# Altium schematic sheet td2_cpu_r00.SchDoc
size B
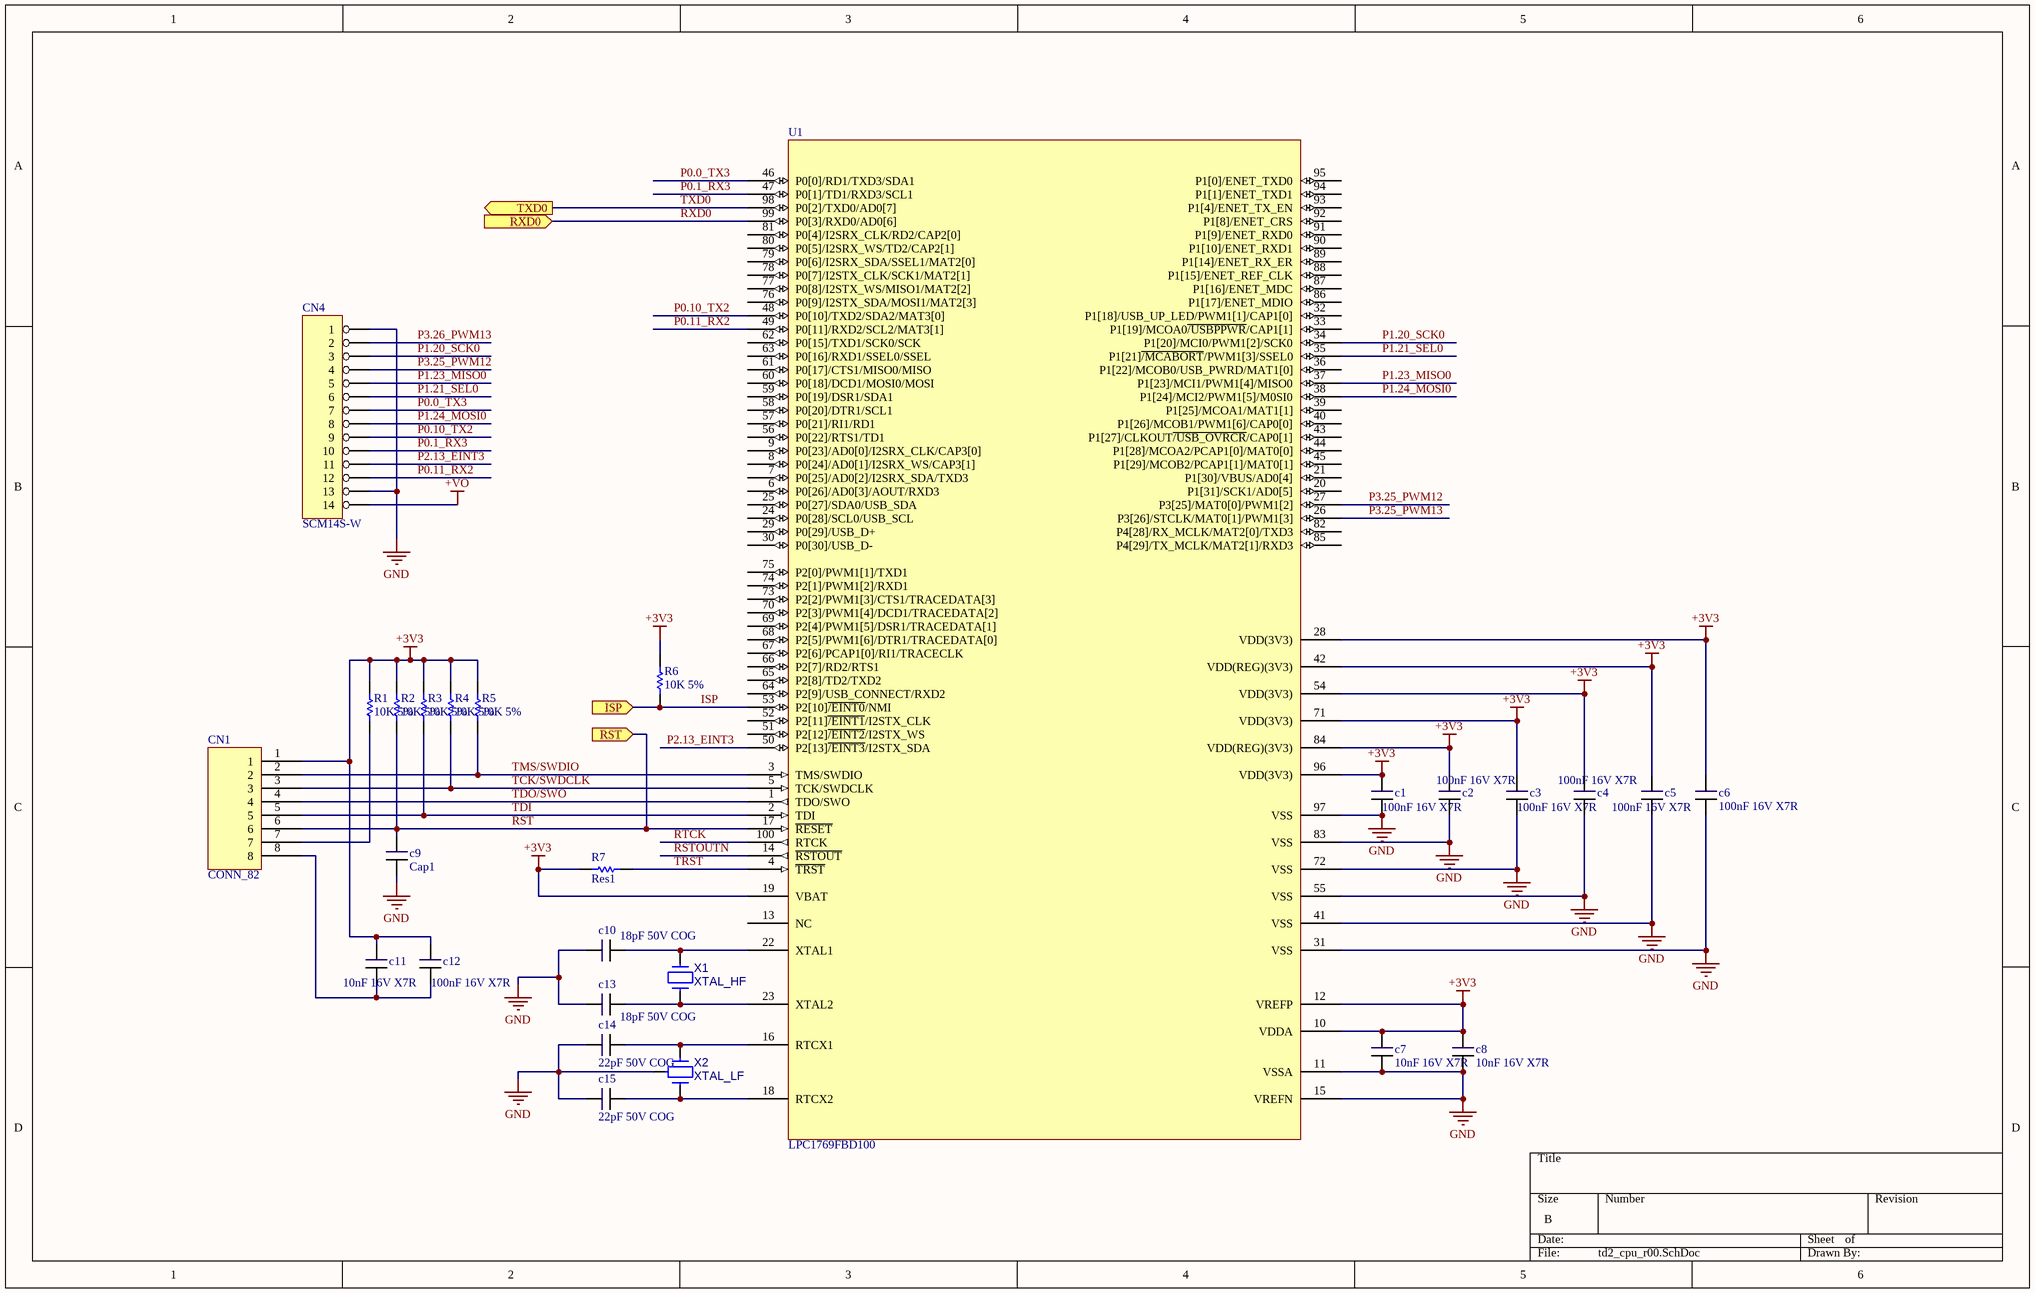
[diagram p0: td2_cpu_r00.SchDoc]

## Parts
c1  100nF 16V X7R
c2  100nF 16V X7R
c3  100nF 16V X7R
c4  100nF 16V X7R
c5  100nF 16V X7R
c6  100nF 16V X7R
c7  10nF 16V X7R
c8  10nF 16V X7R
c9  Cap1
c10  18pF 50V COG
c11  10nF 16V X7R
c12  100nF 16V X7R
c13  18pF 50V COG
c14  22pF 50V COG
c15  22pF 50V COG
CN1  CONN_82
CN4  SCM14S-W
R1  10K 5%
R2  10K 5%
R3  10K 5%
R4  10K 5%
R5  10K 5%
R6  10K 5%
R7  Res1
U1  LPC1769FBD100  [LQFP100]
X1  XTAL_HF
X2  XTAL_LF

## Ports
ISP (in), RST (in), RXD0 (in), TXD0 (out)

## Nets
+3V3: c1.2 c2.2 c3.2 c4.2 c5.2 c6.2 c7.2 c8.2 c11.2 c12.2 CN1.1 R1.2 R2.2 R3.2 R4.2 R5.2 R6.1 R7.2 U1.10(VDDA) U1.12(VREFP) U1.19(VBAT) U1.28(VDD(3V3)) U1.42(VDD(REG)(3V3)) U1.54(VDD(3V3)) U1.71(VDD(3V3)) U1.84(VDD(REG)(3V3)) U1.96(VDD(3V3))
+VO: CN4.14
GND: c1.1(tutu) c2.1(tutu) c3.1(tutu) c4.1(tutu) c5.1(tutu) c6.1(tutu) c7.1(tutu) c8.1(tutu) c9.1(tutu) c10.2 c13.2 c14.2 c15.2 CN4.1 CN4.13 U1.11(VSSA) U1.15(VREFN) U1.31(VSS) U1.41(VSS) U1.55(VSS) U1.72(VSS) U1.83(VSS) U1.97(VSS) X2.3
ISP: R6.2 U1.53(P2[10]~{/EINT0}/NMI) ; port ISP
P0.0_TX3: CN4.7 U1.46(P0[0]/RD1/TXD3/SDA1)
P0.1_RX3: CN4.10 U1.47(P0[1]/TD1/RXD3/SCL1)
P0.10_TX2: CN4.9 U1.48(P0[10]/TXD2/SDA2/MAT3[0])
P0.11_RX2: CN4.12 U1.49(P0[11]/RXD2/SCL2/MAT3[1])
P1.20_SCK0: CN4.3 U1.34(P1[20]/MCI0/PWM1[2]/SCK0)
P1.21_SEL0: CN4.6 U1.35(P1[21]~{/MCABORT}/PWM1[3]/SSEL0)
P1.23_MISO0: CN4.5 U1.37(P1[23]/MCI1/PWM1[4]/MISO0)
P1.24_MOSI0: CN4.8 U1.38(P1[24]/MCI2/PWM1[5]/M0SI0)
P2.13_EINT3: CN4.11 U1.50(P2[13]~{/EINT3}/I2STX_SDA)
P3.25_PWM12: CN4.4 U1.27(P3[25]/MAT0[0]/PWM1[2])
P3.25_PWM13: U1.26(P3[26]/STCLK/MAT0[1]/PWM1[3])
P3.26_PWM13: CN4.2
RST: c9.2 CN1.6 R2.1 U1.17(~{RESET}) ; port RST
RSTOUTN: U1.14(~{RSTOUT})
RTCK: U1.100(RTCK)
RXD0: U1.99(P0[3]/RXD0/AD0[6]) ; port RXD0
TCK/SWDCLK: CN1.3 R4.1 U1.5(TCK/SWDCLK)
TDI: CN1.5 R3.1 U1.2(TDI)
TDO/SWO: CN1.4 U1.1(TDO/SWO)
TMS/SWDIO: CN1.2 R5.1 U1.3(TMS/SWDIO)
TRST: R7.1 U1.4(~{TRST})
TXD0: U1.98(P0[2]/TXD0/AD0[7]) ; port TXD0
Netc10_1: c10.1(tutu) U1.22(XTAL1) X1.1
Netc11_1: c11.1(tutu) c12.1(tutu) CN1.8
Netc13_1: c13.1(tutu) U1.23(XTAL2) X1.2
Netc14_1: c14.1(tutu) U1.16(RTCX1) X2.2
Netc15_1: c15.1(tutu) U1.18(RTCX2) X2.1
NetCN1_7: CN1.7 R1.1

Not connected (* = marked no-connect by the designer): U1 6(P0[26]/AD0[3]/AOUT/RXD3) 7(P0[25]/AD0[2]/I2SRX_SDA/TXD3) 8(P0[24]/AD0[1]/I2SRX_WS/CAP3[1]) 9(P0[23]/AD0[0]/I2SRX_CLK/CAP3[0]) 13(NC) 20(P1[31]/SCK1/AD0[5]) 21(P1[30]/VBUS/AD0[4]) 24(P0[28]/SCL0/USB_SCL) 25(P0[27]/SDA0/USB_SDA) 29(P0[29]/USB_D+) 30(P0[30]/USB_D-) 32(P1[18]/USB_UP_LED/PWM1[1]/CAP1[0]) 33(P1[19]/MCOA0~{/USBPPWR}/CAP1[1]) 36(P1[22]/MCOB0/USB_PWRD/MAT1[0]) 39(P1[25]/MCOA1/MAT1[1]) 40(P1[26]/MCOB1/PWM1[6]/CAP0[0]) 43(P1[27]/CLKOUT~{/USB_OVRCR}/CAP0[1]) 44(P1[28]/MCOA2/PCAP1[0]/MAT0[0]) 45(P1[29]/MCOB2/PCAP1[1]/MAT0[1]) 51(P2[12]~{/EINT2}/I2STX_WS) 52(P2[11]~{/EINT1}/I2STX_CLK) 56(P0[22]/RTS1/TD1) 57(P0[21]/RI1/RD1) 58(P0[20]/DTR1/SCL1) 59(P0[19]/DSR1/SDA1) 60(P0[18]/DCD1/MOSI0/MOSI) 61(P0[17]/CTS1/MISO0/MISO) 62(P0[15]/TXD1/SCK0/SCK) 63(P0[16]/RXD1/SSEL0/SSEL) 64(P2[9]/USB_CONNECT/RXD2) 65(P2[8]/TD2/TXD2) 66(P2[7]/RD2/RTS1) 67(P2[6]/PCAP1[0]/RI1/TRACECLK) 68(P2[5]/PWM1[6]/DTR1/TRACEDATA[0]) 69(P2[4]/PWM1[5]/DSR1/TRACEDATA[1]) 70(P2[3]/PWM1[4]/DCD1/TRACEDATA[2]) 73(P2[2]/PWM1[3]/CTS1/TRACEDATA[3]) 74(P2[1]/PWM1[2]/RXD1) 75(P2[0]/PWM1[1]/TXD1) 76(P0[9]/I2STX_SDA/MOSI1/MAT2[3]) 77(P0[8]/I2STX_WS/MISO1/MAT2[2]) 78(P0[7]/I2STX_CLK/SCK1/MAT2[1]) 79(P0[6]/I2SRX_SDA/SSEL1/MAT2[0]) 80(P0[5]/I2SRX_WS/TD2/CAP2[1]) 81(P0[4]/I2SRX_CLK/RD2/CAP2[0]) 82(P4[28]/RX_MCLK/MAT2[0]/TXD3) 85(P4[29]/TX_MCLK/MAT2[1]/RXD3) 86(P1[17]/ENET_MDIO) 87(P1[16]/ENET_MDC) 88(P1[15]/ENET_REF_CLK) 89(P1[14]/ENET_RX_ER) 90(P1[10]/ENET_RXD1) 91(P1[9]/ENET_RXD0) 92(P1[8]/ENET_CRS) 93(P1[4]/ENET_TX_EN) 94(P1[1]/ENET_TXD1) 95(P1[0]/ENET_TXD0)

## Library data of the parts
c1-c15 = Cap1: Capacitor
CN4 = CONN_14P: Connector 14 Vias
R1-R7 = Res1: Resistor
U1 = LPC1768FBD100: CPU Cortex M3
X1 = XTAL_HF: Crystal
X2 = XTAL_LF: Crystal